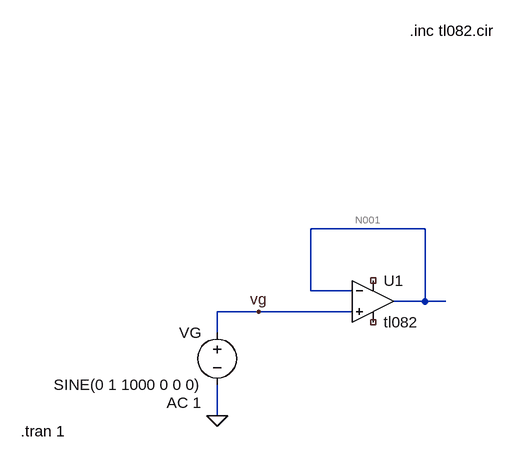
[diagram p0: schematic UnityGain.asc]
UnityGain.asc, the LTspice schematic file:
Version 4
SHEET 1 948 680
WIRE 256 64 80 64
WIRE 80 160 80 64
WIRE 144 160 80 160
WIRE 256 176 256 64
WIRE 256 176 208 176
WIRE 288 176 256 176
WIRE 0 192 -64 192
WIRE 144 192 0 192
WIRE -64 224 -64 192
WIRE -64 352 -64 304
FLAG -64 352 0
FLAG 0 192 vg
SYMBOL voltage -64 208 M0
WINDOW 123 24 124 Left 2
WINDOW 39 0 0 Left 2
SYMATTR Value2 AC 1
SYMATTR InstName VG
SYMATTR Value SINE(0 1 1000 0 0 0)
SYMBOL Opamps\\opamp2 176 112 R0
SYMATTR InstName U1
SYMATTR Value tl082
TEXT 232 -240 Left 2 !.inc tl082.cir
TEXT -366 376 Left 2 !.tran 1

The netlist it stands for:
* UnityGain.asc
VG vg 0 SINE(0 1 1000 0 0 0) AC 1
XU1 vg N001 NC_01 NC_02 N001 tl082  ; pins In+ In- V+ V- OUT
.inc tl082.cir
.tran 1
.backanno
.end

* Results of the author's LTspice run, read from the files saved beside the schematic
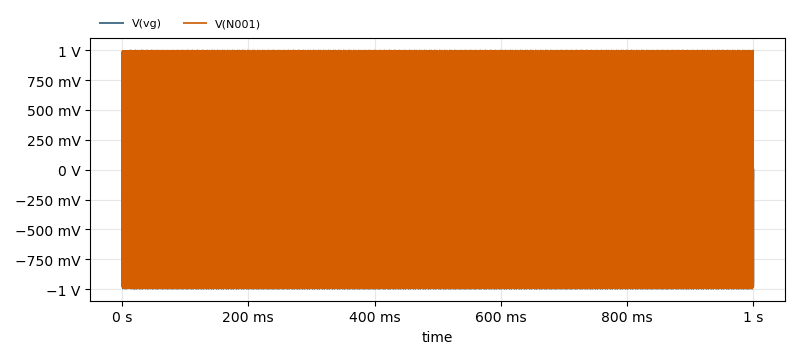
[diagram p1: Transient Analysis of UnityGain.asc, plotted from the saved traces]
* Transient Analysis, 1 run:
*   V(vg): min -997 mV, max 997 mV, average 176 µV, rms 698.2 mV, last 0 V
*   V(N001): min -995.8 mV, max 998.3 mV, average 1.457 mV, rms 698.2 mV, last 984 µV